# EAGLE design eDNA Board V2 (EAGLE 9.6.2)

## Sheet 1 of 2: Logic + Sensor
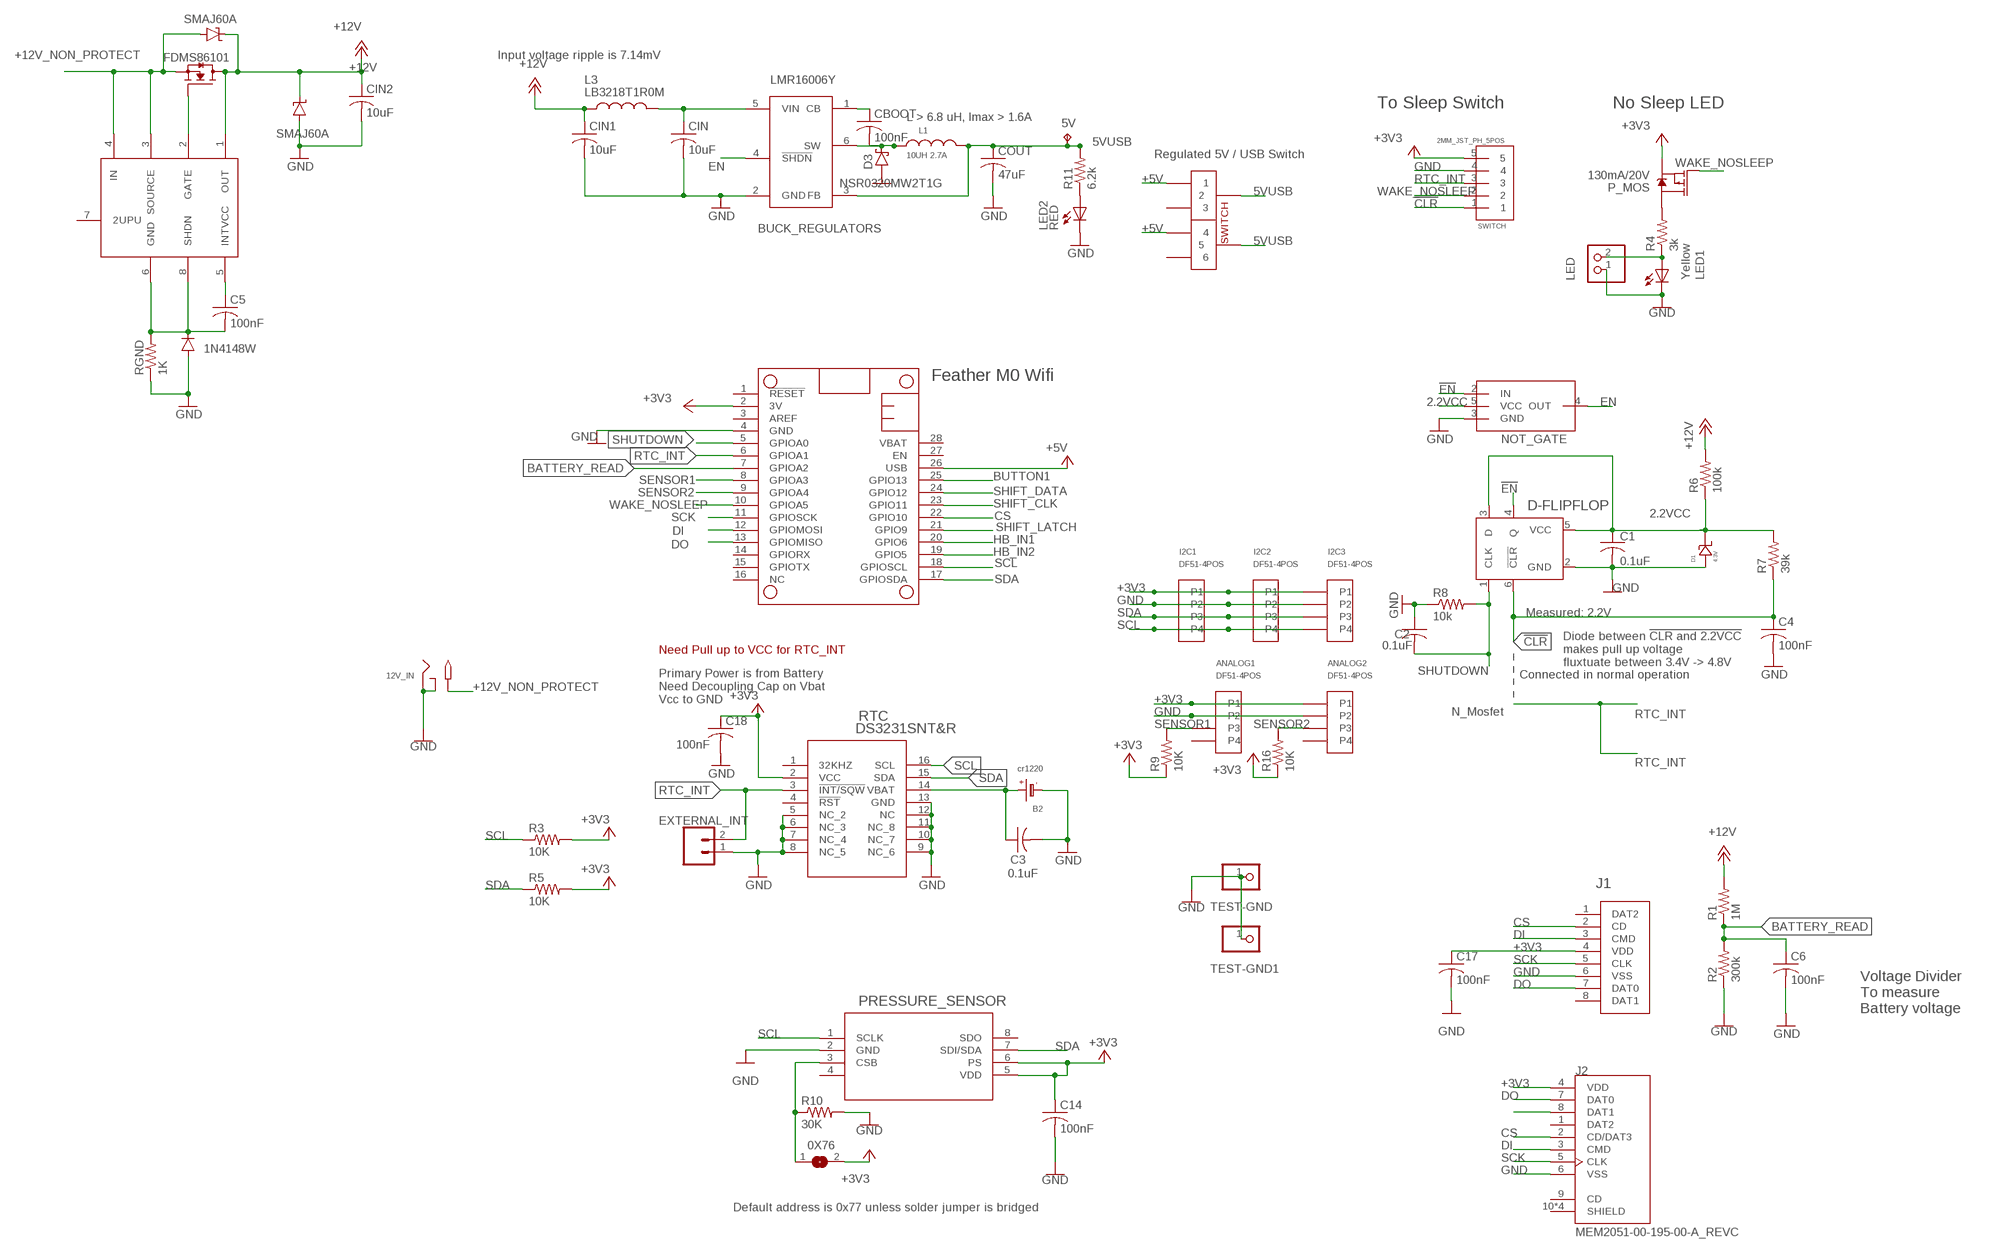
[diagram p0: schematic, sheet 1]

### Parts
0X76  SJ  [SJ]
5V  TPTP16R  [TP16R]
12V_IN  2.1MMJACKSMT  [DCJACK_2MM_SMT]
ANALOG1  DF51-4POS  [DF51-4POS]
ANALOG2  DF51-4POS  [DF51-4POS]
B2  cr1220  BATTERYCR1220_2  [CR1220-2]
C1  0.1uF  C-USC1206  [C1206]
C2  0.1uF  C-USC1206  [C1206]
C3  0.1uF  C-USC1206  [C1206]
C4  100nF  C-USC1206  [C1206]
C5  100nF  C-USC1206  [C1206]
C6  100nF  C-USC1206  [C1206]
C14  100nF  C-USC1206  [C1206]
C17  100nF  C-USC1206  [C1206]
C18  100nF  C-USC1206  [C1206]
CBOOT  100nF  C-USC1206  [C1206]
CIN  10uF  C-USC1206K  [C1206K]
CIN1  10uF  C-USC1206K  [C1206K]
CIN2  10uF  C-USC1206K  [C1206K]
COUT  47uF  C-USC1206  [C1206]
D1  4.3V  ZENER-DO219  [DO-219AC]
D2  1N4148W  [SOD-123_MINI-SMA]
D3  NSR0320MW2T1G  BAT60J  [SOD323_ST]
D4  SMAJ60A  [DO_214]
D5  SMAJ60A  [DO_214]
D-FLIPFLOP  SN74LVC1G175DBVR  [DBV6]
EXTERNAL_INT  CONN_021X02_NO_SILK  [1X02_NO_SILK]
I2C1  DF51-4POS  [DF51-4POS]
I2C2  DF51-4POS  [DF51-4POS]
I2C3  DF51-4POS  [DF51-4POS]
J1  PJS008U-3000-0  [CONN_PJS008U-3000-0_YAM]
J2  MEM2051-00-195-00-A_REVC  [GCT_MEM2051-00-195-00-A_REVC]
L1  10UH 2.7A  WE-MAPI_4030_74438357100  [WE-MAPI_40XX]
L3  LB3218T1R0M  [INDC3218X200N]
LED  2.5MM_JST_UP_2POS  [JST_2POS_2.5MM_UP]
LED1  Yellow  LEDCHIPLED_0805  [CHIPLED_0805]
LED2  RED  LEDCHIPLED_0805  [CHIPLED_0805]
MS1  FEATHERWING  [FEATHERWING]
NMOS  FDMS86101  [8-POWERTDFN]
P_MOS  130mA/20V  MOSFET_PCH-IRLML2244  [SOT23-3]
PRESSURE_SENSOR  MS580302BA01-00  [MS5803-02BA01]
R1  1M  R-US_R1206  [R1206]
R2  300k  R-US_R1206  [R1206]
R3  10K  R-US_R1206  [R1206]
R4  3k  R-US_R1206  [R1206]
R5  10K  R-US_R1206  [R1206]
R6  100k  R-US_R1206  [R1206]
R7  39k  R-US_R1206  [R1206]
R8  10k  R-US_R1206  [R1206]
R9  10K  R-US_R1206  [R1206]
R10  30K  R-US_R1206  [R1206]
R11  6.2k  WSLP1206R0500FEA  [RES_1206]
R16  10K  R-US_R1206  [R1206]
RGND  1K  R-US_R1206  [R1206]
RTC  DS3231SNT&R  [21-0042B_16]
SWITCH  2MM_JST_PH_5POS  [2MM_5POS_HEADER]
TEST-GND  PINHD-1X1  [1X01]
TEST-GND1  PINHD-1X1  [1X01]
U$1  2PDT_SWITCHJS-SMD  [JS-DPDT-SMD]
U$3  NOT_GATE  [SOT753]
U$7  LTC4372  [SOP65P640X120-8N]
VREG  BUCK_REGULATORS  [SOT23-6]

### Nets
2.2VCC [sig]: C1.1 D1.FNT D-FLIPFLOP.3(D) D-FLIPFLOP.5(VCC) R6.1 R7.2 U$3.5(VCC)
5VUSB: 5V.TP COUT.1 L1.2 R11.2 U$1.P$2 U$1.P$5 VREG.3(FB)
!CLR: C4.1 D-FLIPFLOP.6(!CLR) R7.1 SWITCH.1
!EN: D-FLIPFLOP.4(Q) U$3.2(IN)
+3V3: 0X76.2 ANALOG1.P$1(P1) ANALOG2.P$1(P1) C14.1 C17.1 C18.1 I2C1.P$1(P1) I2C2.P$1(P1) I2C3.P$1(P1) J1.4(VDD) J2.4(VDD) MS1.2(3V) P_MOS.2(S) PRESSURE_SENSOR.5(VDD) PRESSURE_SENSOR.6(PS) R3.2 R5.2 R9.1 R16.1 RTC.2(VCC) SWITCH.5 ; also sheet 2
+5V: MS1.26(USB) U$1.P$1 U$1.P$4 ; also sheet 2
+12V [12v]: CIN1.1 CIN2.1 D4.C D5.C L3.1 NMOS.5(D) NMOS.6(D) NMOS.7(D) NMOS.8(D) NMOS.9(D) R1.2 R6.2 U$7.1(OUT) ; also sheet 2
+12V_NON_PROTECT [12v]: 12V_IN.PWR2(TIP) D5.A NMOS.1(S) NMOS.2(S) NMOS.3(S) U$7.3(SOURCE) U$7.4(IN)
BATTERY_READ: C6.1 MS1.7(GPIOA2) R1.1 R2.2
BUTTON1: MS1.25(GPIO13)
CS: J1.2(CD) J2.2(CD/DAT3) MS1.22(GPIO10)
DI: J1.3(CMD) J2.3(CMD) MS1.12(GPIOMOSI)
DO: J1.7(DAT0) J2.7(DAT0) MS1.13(GPIOMISO)
EN: U$3.4(OUT) VREG.4(!SHDN)
GND: 12V_IN.GND(RING) 12V_IN.GNDBREAK(RING_SW) ANALOG1.P$2(P2) ANALOG2.P$2(P2) B2.- C1.2 C2.1 C3.2 C4.2 C6.2 C14.2 C17.2 C18.2 CIN1.2 CIN2.2 CIN.2 COUT.2 D1.BCK D2.A D3.A D4.A D-FLIPFLOP.2(GND) EXTERNAL_INT.1 I2C1.P$2(P2) I2C2.P$2(P2) I2C3.P$2(P2) J1.6(VSS) J2.6(VSS) LED1.C LED2.C LED.1 MS1.4(GND) PRESSURE_SENSOR.2(GND) R2.1 R8.1 R10.2 RGND.1 RTC.5(NC_2) RTC.6(NC_3) RTC.7(NC_4) RTC.8(NC_5) RTC.9(NC_6) RTC.10(NC_7) RTC.11(NC_8) RTC.12(NC) RTC.13(GND) SWITCH.4 TEST-GND1.1 TEST-GND.1 U$3.3(GND) VREG.2(GND) ; also sheet 2
HB_IN1: MS1.20(GPIO6) ; also sheet 2
HB_IN2: MS1.19(GPIO5) ; also sheet 2
N$1: B2.+ C3.1 RTC.14(VBAT)
N$2: P_MOS.3(D) R4.2
N$3: LED1.A LED.2 R4.1
N$6: 0X76.1 PRESSURE_SENSOR.3(CSB) R10.1
N$8: NMOS.4(G) U$7.2(GATE)
N$10: J2.8(DAT1)
N$12: LED2.A R11.1
N$15: CIN.1 L3.2 VREG.5(VIN)
N$16: CBOOT.1 VREG.1(CB)
N$17: CBOOT.2 D3.C L1.1 VREG.6(SW)
N$18: C5.1 U$7.5(INTVCC)
N$19: C5.2 D2.C RGND.2 U$7.6(GND) U$7.8(SHDN)
RTC_INT: EXTERNAL_INT.2 MS1.6(GPIOA1) RTC.3(!INT/SQW) SWITCH.3
SCK: J1.5(CLK) J2.5(CLK) MS1.11(GPIOSCK)
SCL: I2C1.P$4(P4) I2C2.P$4(P4) I2C3.P$4(P4) MS1.18(GPIOSCL) PRESSURE_SENSOR.1(SCLK) R3.1 RTC.16(SCL)
SDA: I2C1.P$3(P3) I2C2.P$3(P3) I2C3.P$3(P3) MS1.17(GPIOSDA) PRESSURE_SENSOR.7(SDI/SDA) R5.1 RTC.15(SDA)
SENSOR1: ANALOG1.P$3(P3) MS1.8(GPIOA3) R9.2
SENSOR2: ANALOG2.P$3(P3) MS1.9(GPIOA4) R16.2
SHIFT_CLK: MS1.23(GPIO11) ; also sheet 2
SHIFT_DATA: MS1.24(GPIO12) ; also sheet 2
SHIFT_LATCH: MS1.21(GPIO9) ; also sheet 2
SHUTDOWN: C2.2 D-FLIPFLOP.1(CLK) MS1.5(GPIOA0) R8.2
WAKE_NOSLEEP: MS1.10(GPIOA5) P_MOS.1(G) SWITCH.2
Unconnected: ANALOG1.P$4(P4) ANALOG2.P$4(P4) J1.1(DAT2) J1.8(DAT1) J2.1(DAT2) J2.9(CD) J2.10(SHIELD) J2.11(SHIELD) J2.12(SHIELD) J2.13(SHIELD) MS1.1(!RESET) MS1.3(AREF) MS1.14(GPIORX) MS1.15(GPIOTX) MS1.16(NC) MS1.27(EN) MS1.28(VBAT) PRESSURE_SENSOR.4(NC) PRESSURE_SENSOR.8(SDO) RTC.1(32KHZ) RTC.4(!RST) U$1.P$3 U$1.P$6 U$7.7(2UPU)

### Notes on the sheet
- Input voltage ripple is 7.14mV
- To Sleep Switch | No Sleep LED
- L > 6.8 uH, Imax > 1.6A
- Regulated 5V / USB Switch
- Feather M0 Wifi
- Measured: 2.2V
- Need Pull up to VCC for RTC_INT
- Diode between !CLR and 2.2VCC
  makes pull up voltage 
  fluxtuate between 3.4V -> 4.8V
- Connected in normal operation
- Primary Power is from Battery
  Need Decoupling Cap on Vbat
  Vcc to GND
- N_Mosfet
- Voltage Divider
  To measure 
  Battery voltage
- Default address is 0x77 unless solder jumper is bridged

## Sheet 2 of 2: Power
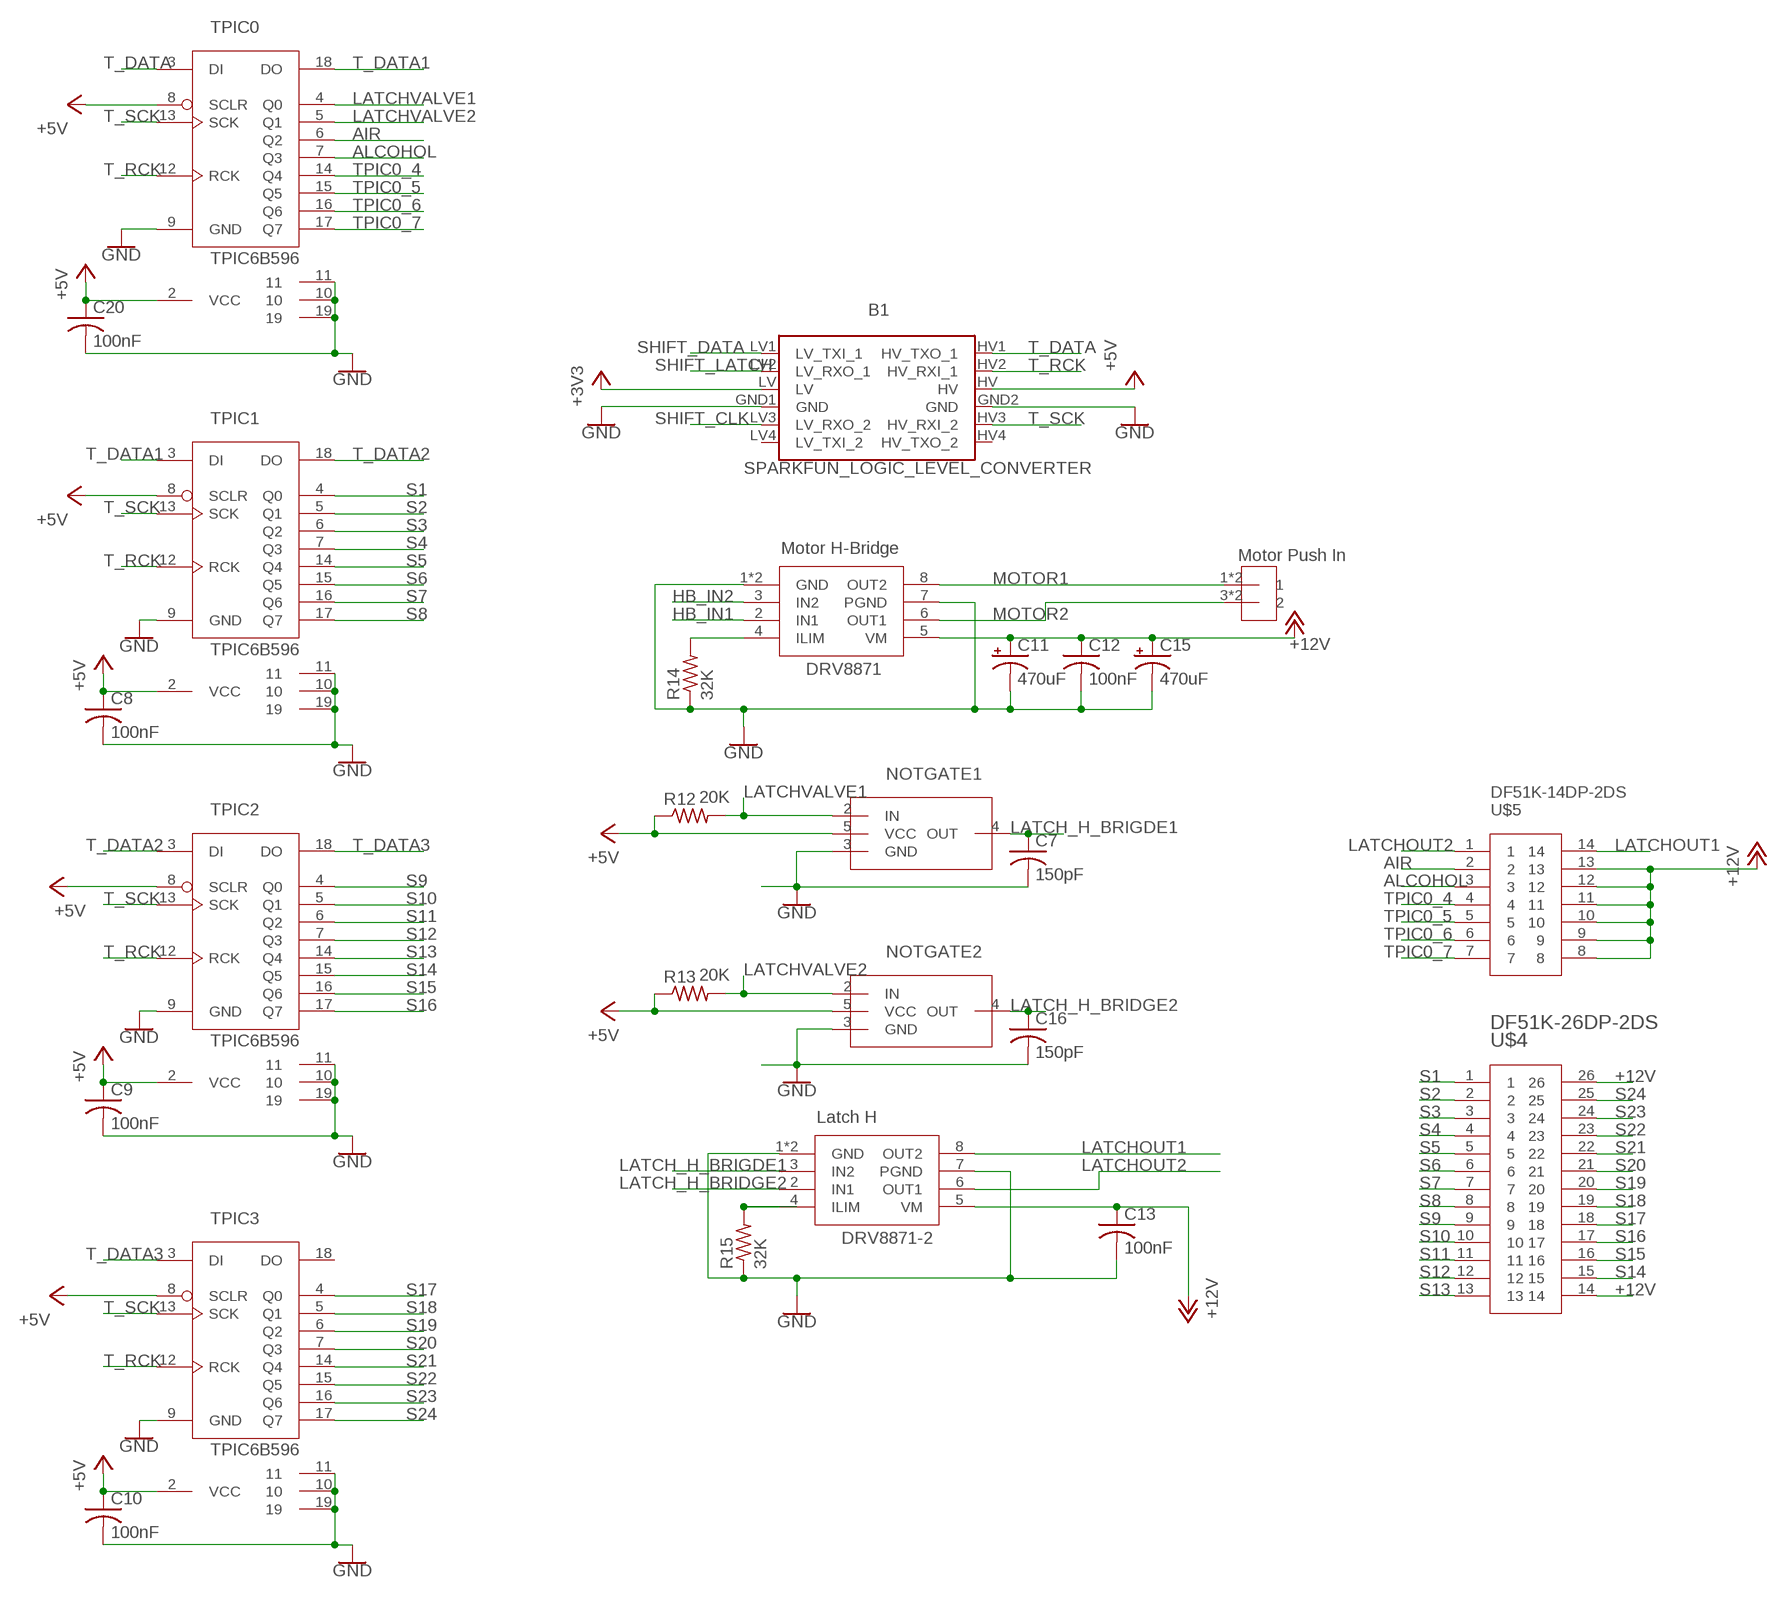
[diagram p1: schematic, sheet 2]

### Parts
B1  SPARKFUN_LOGIC_LEVEL_CONVERTER  [SPARKFUN_LOGIC_LEVEL_CONVERTER]
C7  150pF  C-USC1206  [C1206]
C8  100nF  C-USC1206  [C1206]
C9  100nF  C-USC1206  [C1206]
C10  100nF  C-USC1206  [C1206]
C11  470uF  CPOL-US140CLH-0810  [140CLH-0810]
C12  100nF  C-USC1206  [C1206]
C13  100nF  C-USC1206  [C1206]
C15  470uF  CPOL-US140CLH-0810  [140CLH-0810]
C16  150pF  C-USC1206  [C1206]
C20  100nF  C-USC1206  [C1206]
DRV8871  Motor H-Bridge  DRV8871  [SOP8]
DRV8871-2  Latch H  DRV8871  [SOP8]
NOTGATE1  NOT_GATE  [SOT753]
NOTGATE2  NOT_GATE  [SOT753]
R12  20K  R-US_R1206  [R1206]
R13  20K  R-US_R1206  [R1206]
R14  32K  R-US_R1206  [R1206]
R15  32K  R-US_R1206  [R1206]
TPIC0  TPIC6B596  [DIP20]
TPIC1  TPIC6B596  [DIP20]
TPIC2  TPIC6B596  [DIP20]
TPIC3  TPIC6B596  [DIP20]
U$2  Motor Push In  PUSH_IN_2  [3.5MM_DIP2]
U$4  DF51K-26DP-2DS  [DF51K-26DP-2DS-ANGLE]
U$5  DF51K-14DP-2DS  [DF51K-14DP-2DS-ANGLE]

### Nets
+3V3: B1.LV ; also sheet 1
+5V: B1.HV C8.1 C9.1 C10.1 C20.1 NOTGATE1.5(VCC) NOTGATE2.5(VCC) R12.1 R13.1 TPIC0.2(VCC) TPIC0.8(SCLR) TPIC1.2(VCC) TPIC1.8(SCLR) TPIC2.2(VCC) TPIC2.8(SCLR) TPIC3.2(VCC) TPIC3.8(SCLR) ; also sheet 1
+12V [12v]: C11.+ C12.1 C13.1 C15.+ DRV8871-2.5(VM) DRV8871.5(VM) U$4.14 U$4.26 U$5.8 U$5.9 U$5.10 U$5.11 U$5.12 U$5.13 ; also sheet 1
AIR: TPIC0.6(Q2) U$5.2
ALCOHOL: TPIC0.7(Q3) U$5.3
GND: B1.GND1(GND) B1.GND2(GND) C7.2 C8.2 C9.2 C10.2 C11.- C12.2 C13.2 C15.- C16.2 C20.2 DRV8871-2.1(GND) DRV8871-2.7(PGND) DRV8871-2.GND DRV8871.1(GND) DRV8871.7(PGND) DRV8871.GND NOTGATE1.3(GND) NOTGATE2.3(GND) R14.1 R15.1 TPIC0.9(GND) TPIC0.10 TPIC0.11 TPIC0.19 TPIC1.9(GND) TPIC1.10 TPIC1.11 TPIC1.19 TPIC2.9(GND) TPIC2.10 TPIC2.11 TPIC2.19 TPIC3.9(GND) TPIC3.10 TPIC3.11 TPIC3.19 ; also sheet 1
HB_IN1: DRV8871.2(IN1) ; also sheet 1
HB_IN2: DRV8871.3(IN2) ; also sheet 1
LATCH_H_BRIDGE2: C16.1 DRV8871-2.2(IN1) NOTGATE2.4(OUT)
LATCH_H_BRIGDE1: C7.1 DRV8871-2.3(IN2) NOTGATE1.4(OUT)
LATCHOUT1: DRV8871-2.8(OUT2) U$5.14
LATCHOUT2: DRV8871-2.6(OUT1) U$5.1
LATCHVALVE1: NOTGATE1.2(IN) R12.2 TPIC0.4(Q0)
LATCHVALVE2: NOTGATE2.2(IN) R13.2 TPIC0.5(Q1)
MOTOR1: DRV8871.8(OUT2) U$2.1 U$2.2
MOTOR2: DRV8871.6(OUT1) U$2.3 U$2.4
N$4: DRV8871.4(ILIM) R14.2
N$5: DRV8871-2.4(ILIM) R15.2
S1: TPIC1.4(Q0) U$4.1
S2: TPIC1.5(Q1) U$4.2
S3: TPIC1.6(Q2) U$4.3
S4: TPIC1.7(Q3) U$4.4
S5: TPIC1.14(Q4) U$4.5
S6: TPIC1.15(Q5) U$4.6
S7: TPIC1.16(Q6) U$4.7
S8: TPIC1.17(Q7) U$4.8
S9: TPIC2.4(Q0) U$4.9
S10: TPIC2.5(Q1) U$4.10
S11: TPIC2.6(Q2) U$4.11
S12: TPIC2.7(Q3) U$4.12
S13: TPIC2.14(Q4) U$4.13
S14: TPIC2.15(Q5) U$4.15
S15: TPIC2.16(Q6) U$4.16
S16: TPIC2.17(Q7) U$4.17
S17: TPIC3.4(Q0) U$4.18
S18: TPIC3.5(Q1) U$4.19
S19: TPIC3.6(Q2) U$4.20
S20: TPIC3.7(Q3) U$4.21
S21: TPIC3.14(Q4) U$4.22
S22: TPIC3.15(Q5) U$4.23
S23: TPIC3.16(Q6) U$4.24
S24: TPIC3.17(Q7) U$4.25
SHIFT_CLK: B1.LV3(LV_RXO_2) ; also sheet 1
SHIFT_DATA: B1.LV1(LV_TXI_1) ; also sheet 1
SHIFT_LATCH: B1.LV2(LV_RXO_1) ; also sheet 1
T_DATA: B1.HV1(HV_TXO_1) TPIC0.3(DI)
T_DATA1: TPIC0.18(DO) TPIC1.3(DI)
T_DATA2: TPIC1.18(DO) TPIC2.3(DI)
T_DATA3: TPIC2.18(DO) TPIC3.3(DI)
T_RCK: B1.HV2(HV_RXI_1) TPIC0.12(RCK) TPIC1.12(RCK) TPIC2.12(RCK) TPIC3.12(RCK)
T_SCK: B1.HV3(HV_RXI_2) TPIC0.13(SCK) TPIC1.13(SCK) TPIC2.13(SCK) TPIC3.13(SCK)
TPIC0_4: TPIC0.14(Q4) U$5.4
TPIC0_5: TPIC0.15(Q5) U$5.5
TPIC0_6: TPIC0.16(Q6) U$5.6
TPIC0_7: TPIC0.17(Q7) U$5.7
Unconnected: B1.HV4(HV_TXO_2) B1.LV4(LV_TXI_2) TPIC3.18(DO)

## Library data of the parts
0X76 = jumper:SJ: SMD solder JUMPER
5V = testpad:TP: Test pad
12V_IN = adafruit:2.1MMJACK: 2.1mm x 5.5mm THM DC jack with internal switch. Digikey part #PJ-102A, 4UCON part #05537 2.1mm x 5.5mm SMT DC jack with internal switch. Digikey part #PJ-002A-SMT, 4UCON part #03267 By microbuilder.eu & adafruit.com
ANALOG1 ANALOG2 I2C1-I2C3 = HiroseConnectors:DF51-4POS
B1 = SparkFun-Boards:SPARKFUN_LOGIC_LEVEL_CONVERTER: SparkFun Logic Level Converter -Bi-Directional This is the mechnical outline for the 3.3V - 5V bi directional logic level converter. *Note, the "LOCK" Package has the header pins staggered by an offset of 5 mils (off center line), so that when you slide a row of standard 0.1" headers into the PTH pads, it will hold position vertically. See the follwing turorial for more information on this type of special footprints: Sneaky Footprints <https://www.sparkfun.com/tutorials/114> SparkFun Products: SparkFun Logic Level Converter - Bi-Directional <https://www.sparkfun.com/products/12009>
B2 = microbuilder:BATTERY: CR1220 SMT - Digikey: 3001K-ND CD2032 BAT-HLD-001 - Digikey: BAT-HLD-001-ND
C1-C3 C14 = adafruit:C-US: CAPACITOR, American symbol
C4-C10 C12 C13 C16-C18 C20 = resistor:C-US: CAPACITOR, American symbol
C11 C15 = adafruit:CPOL-US: POLARIZED CAPACITOR, American symbol
CBOOT CIN CIN1 CIN2 COUT = rcl:C-US: CAPACITOR, American symbol; SPICEPREFIX: C
D1 = beach:ZENER-DO219
D2 = Sampler-eDNA:1N4148W
D3 = diode:BAT60J: Schottky barrier diode Source: www.st.com, BAT60J.pdf
D4 D5 = Sampler-eDNA:SMAJ60A
D-FLIPFLOP = eDNA:SN74LVC1G175DBVR: D Flipflop with clear - https://www.digikey.com/product-detail/en/texas-instruments/SN74LVC1G175DBVR/296-17617-1-ND/706599; MANUFACTURER_PART_NUMBER: SN74LVC1G175DBVR; VENDOR: Texas Instruments
DRV8871 DRV8871-2 = eDNA:DRV8871
EXTERNAL_INT = SparkFun-Connectors:CONN_02: Multi connection point. Often used as Generic Header-pin footprint for 0.1 inch spaced/style header connections On any of the 0.1 inch spaced packages, you can populate with these: Break Away Headers - Straight <https://www.sparkfun.com/products/116> (PRT-00116) Break Away Male Headers - Right Angle <https://www.sparkfun.com/products/553> (PRT-00553) Female Headers <https://www.sparkfun.com/products/115> (PRT-00115) Break Away Headers - Machine Pin <https://www.sparkfun.com/products/117> (PRT-00117) Break Away Female Headers - Swiss Machine Pin <https://www.sparkfun.com/products/743> (PRT-00743) For SCREWTERMINALS and SPRING TERMINALS visit here: Screw Terimnals on SparkFun.com <https://www.sparkfun.com/search/results?term=Screw+Terminals> (5mm/3.5mm/2.54mm spacing) This device is also useful as a general connection point to wire up your design to another part of your project. Our various solder wires solder well into these plated through hole pads. Hook-Up Wire - Assortment (Stranded, 22 AWG) <https://www.sparkfun.com/products/11375> (PRT-11375) Hook-Up Wire - Assortment (Solid Core, 22 AWG) <https://www.sparkfun.com/products/11367> (PRT-11367) View the entire wire category on our website here <https://www.sparkfun.com/categories/141> Special notes: Molex polarized connector foot print use with: PRT-08233 with associated crimp pins and housings. 2.54_SCREWTERM for use with PRT-10571. 3.5mm Screw Terminal footprints for PRT-08084 5mm Screw Terminal footprints for use with PRT-08432
J1 = Sampler-eDNA:PJS008U-3000-0; BUILT_BY: EMA_Anthony; COPYRIGHT: Copyright (C) 2018 Accelerated Designs. All rights reserved; MANUFACTURER_PART_NUMBER: PJS008U-3000-0; SOURCELIBRARY: Yamaichi_2019-10-11; VENDOR: Yamaichi
J2 = Sampler-eDNA:MEM2051-00-195-00-A_REVC: Micro SD Memory Card Connector, 1.88mm Profile SMT,Push Push, with normally closed switch Check prices <https://pricing.snapeda.com/parts/MEM2051-00-195-00-A/Global%20Connector%20Technology/view-part?ref=eda>; AVAILABILITY: Warning; DESCRIPTION: 9 (8 + 1) Position Card Connector microSD Surface Mount, Right Angle Gold, 1.95mm profile, Normally open switch, Push push, Top mount; MF: Global Connector Technology; MP: MEM2051-00-195-00-A; PACKAGE: None; PRICE: None
L1 = EMCComponents (rev19e):WE-MAPI_4030: SMD Metal Alloy Power Inductor Characteristics Magnetic iron alloy allows high rated currents Compact design Magnetically shielded High current capability and handles high transient current spikes Low acoustic noise and low leakage flux noise Operating temperature: –40 °C to 125 °C Applications DC/DC-converter for high current power supplies DC/DC-converter for Field Programmable Gate Array (FPGA) POL-converters Portable power like PDA, digital camera Mainboards/graphic cards Battery powered devices Wireless communication devices Power supplies for smartphones, tablet PCs and other mobile devices <http://katalog.we-online.de/media/images/v2/Family_WE-MAPI.jpg> Details see: http://katalog.we-online.de/en/pbs/WE-MAPI? Updated by Dan Xu 2014-07-08 2014 (C) Wurth Elektronik; WE-NUMBER: 74438357100/10uH
L3 = LB3218T1R0M:LB3218T1R0M: INDUCTOR, 1µH, 1.075A, ±20%; Inductance:1µH; Inductance Tolerance:± 20%; DC Resistance Max:60mohm; DC Current Rating:1.075A; Self Resonant Frequency:100MHz; Series:LB; Core Material:Ferrite; Inductor Case Style:SMD; No. of Pins:2 ;RoHS Compliant: No; DESCRIPTION: 1µH Unshielded Wirewound Inductor 1.075A 60mOhm 1207 (3218 Metric); DIGI-KEY_PART_NUMBER: 587-2032-1-ND; MF: Taiyo Yuden; MP: LB3218T1R0M; PACKAGE: 3218 Taiyo Yuden; PURCHASE-URL: https://pricing.snapeda.com/search/part/LB3218T1R0M/?ref=eda
LED = eDNA:2.5MM_JST_UP_2POS
LED1 LED2 = adafruit:LED: LED OSRAM: - CHIPLED LG R971, LG N971, LY N971, LG Q971, LY Q971, LO R971, LY R971 LH N974, LH R974 LS Q976, LO Q976, LY Q976 LO Q996 - Hyper CHIPLED LW Q18S LB Q993, LB Q99A, LB R99A - SideLED LS A670, LO A670, LY A670, LG A670, LP A670 LB A673, LV A673, LT A673, LW A673 LH A674 LY A675 LS A676, LA A676, LO A676, LY A676, LW A676 LS A679, LY A679, LG A679 - Hyper Micro SIDELED® LS Y876, LA Y876, LO Y876, LY Y876 LT Y87S - SmartLED LW L88C, LW L88S LB L89C, LB L89S, LG L890 LS L89K, LO L89K, LY L89K LS L896, LA L896, LO L896, LY L896 - TOPLED LS T670, LO T670, LY T670, LG T670, LP T670 LSG T670, LSP T670, LSY T670, LOP T670, LYG T670 LG T671, LOG T671, LSG T671 LB T673, LV T673, LT T673, LW T673 LH T674 LS T676, LA T676, LO T676, LY T676, LB T676, LH T676, LSB T676, LW T676 LB T67C, LV T67C, LT T67C, LS T67K, LO T67K, LY T67K, LW E67C LS E67B, LA E67B, LO E67B, LY E67B, LB E67C, LV E67C, LT E67C LW T67C LS T679, LY T679, LG T679 LS T770, LO T770, LY T770, LG T770, LP T770 LB T773, LV T773, LT T773, LW T773 LH T774 LS E675, LA E675, LY E675, LS T675 LS T776, LA T776, LO T776, LY T776, LB T776 LHGB T686 LT T68C, LB T68C - Hyper Mini TOPLED® LB M676 - Mini TOPLED Santana® LG M470 LS M47K, LO M47K, LY M47K Source: http://www.osram.convergy.de/
MS1 = adafruit:FEATHERWING
NMOS = Sampler-eDNA:FDMS86101
NOTGATE1 NOTGATE2 U$3 = eDNA:NOT_GATE
P_MOS = SparkFun-DiscreteSemi:MOSFET_PCH: P-channel MOSFETs Voltage controlled devices that allow control of high current outputs. SparkFun Products: SparkFun ESP32 Thing <https://www.sparkfun.com/products/13907> SparkFun ESP8266 Thing <https://www.sparkfun.com/products/13231>; PROD_ID: TRANS-11153; VALUE: 4.3A/20V/54mΩ
PRESSURE_SENSOR = eDNA:MS580302BA01-00: Pressure sensor https://www.digikey.com/product-detail/en/te-connectivity-measurement-specialties/MS580302BA01-00/223-1624-5-ND/5277629; MANUFACTURER_PART_NUMBER: MS580302BA0100; VENDOR: TE Connectivity
R1 R2 R6-R8 R10 R12 R13 = adafruit:R-US_: RESISTOR, American symbol
R3 R5 R9 R14-R16 RGND = rcl:R-US_: RESISTOR, American symbol; SPICEPREFIX: R
R4 = resistor:R-US_: RESISTOR, American symbol
R11 = Resistor_Capacitor:WSLP1206R0500FEA: RES 0.05 OHM 1% 1W 1206 Manufacturer's datasheet <http://www.vishay.com/docs/30122/wslp.pdf>; CREATED_BY: PCBLayout.com; DIGIKEY_PART_NUMBER: WSLP-.05TR-ND; MANUFACTURER: Vishay Dale; MPN: WSLP1206R0500FEA; PACKAGE: SMD 1206
RTC = eDNA:DS3231SNT&R: Real-time clock, RTC, DS3231 https://www.digikey.com/products/en?keywords=DS3231SN%23T%26RCT-ND; MANUFACTURER_PART_NUMBER: DS3231SN#T&R; VENDOR: Maxim Integrated Products
SWITCH = eDNA:2MM_JST_PH_5POS: 5POS JST female, 5 position https://www.digikey.com/product-detail/en/jst-sales-america-inc/B5B-PH-K-S-LF-SN/455-1707-ND/926614
TEST-GND TEST-GND1 = adafruit:PINHD-1X1: Pin header 1x1 for 0.1" spacing With round pins
TPIC0 TPIC1-TPIC3 = eDNA:TPIC6B596
U$1 = eDNA:2PDT_SWITCH: Double Pole Double Throw ON OFF ON switch. https://www.digikey.com/product-detail/en/e-switch/100DP1T1B1M2QEH/EG2400-ND/378869
U$2 = eDNA:PUSH_IN_2: Push in to connect Phoenix Contact - 3.5 mm through hole Can be ordered from : https://www.digikey.com/product-detail/en/phoenix-contact/1864286/277-12184-ND/6605434 OpenSensingLab OSU
U$4 = Sampler-eDNA:DF51K-26DP-2DS
U$5 = Sampler-eDNA:DF51K-14DP-2DS
U$7 = Sampler-eDNA:LTC4372
VREG = eDNA:BUCK_REGULATORS

## Net classes
1 12v: width 0.356 mm, clearance 0.254 mm
3 sig: width 0.152 mm, clearance 0.2 mm

## Board
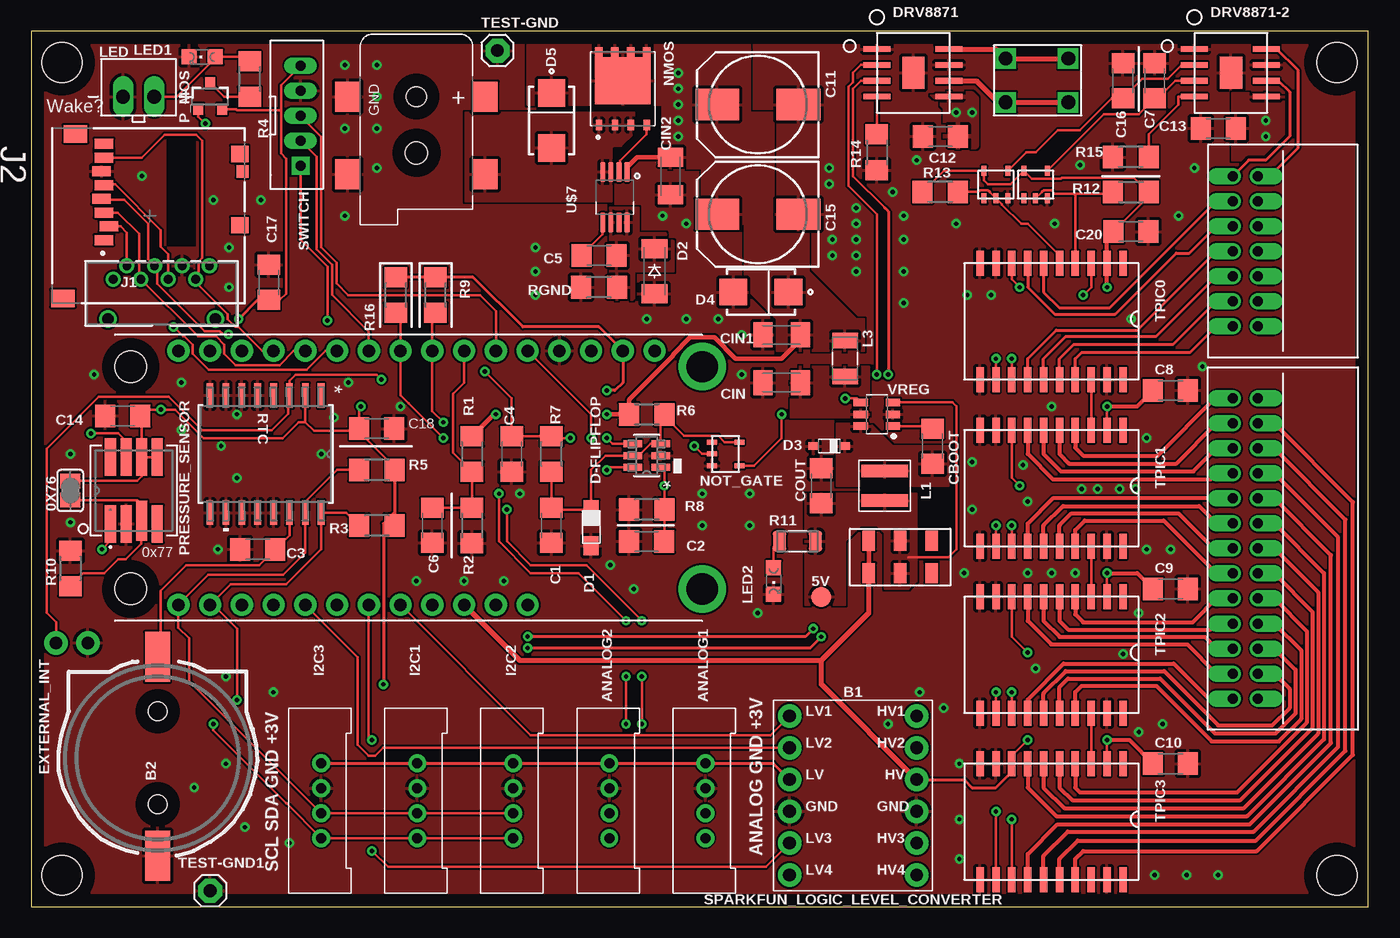
[diagram p2: board, top side]
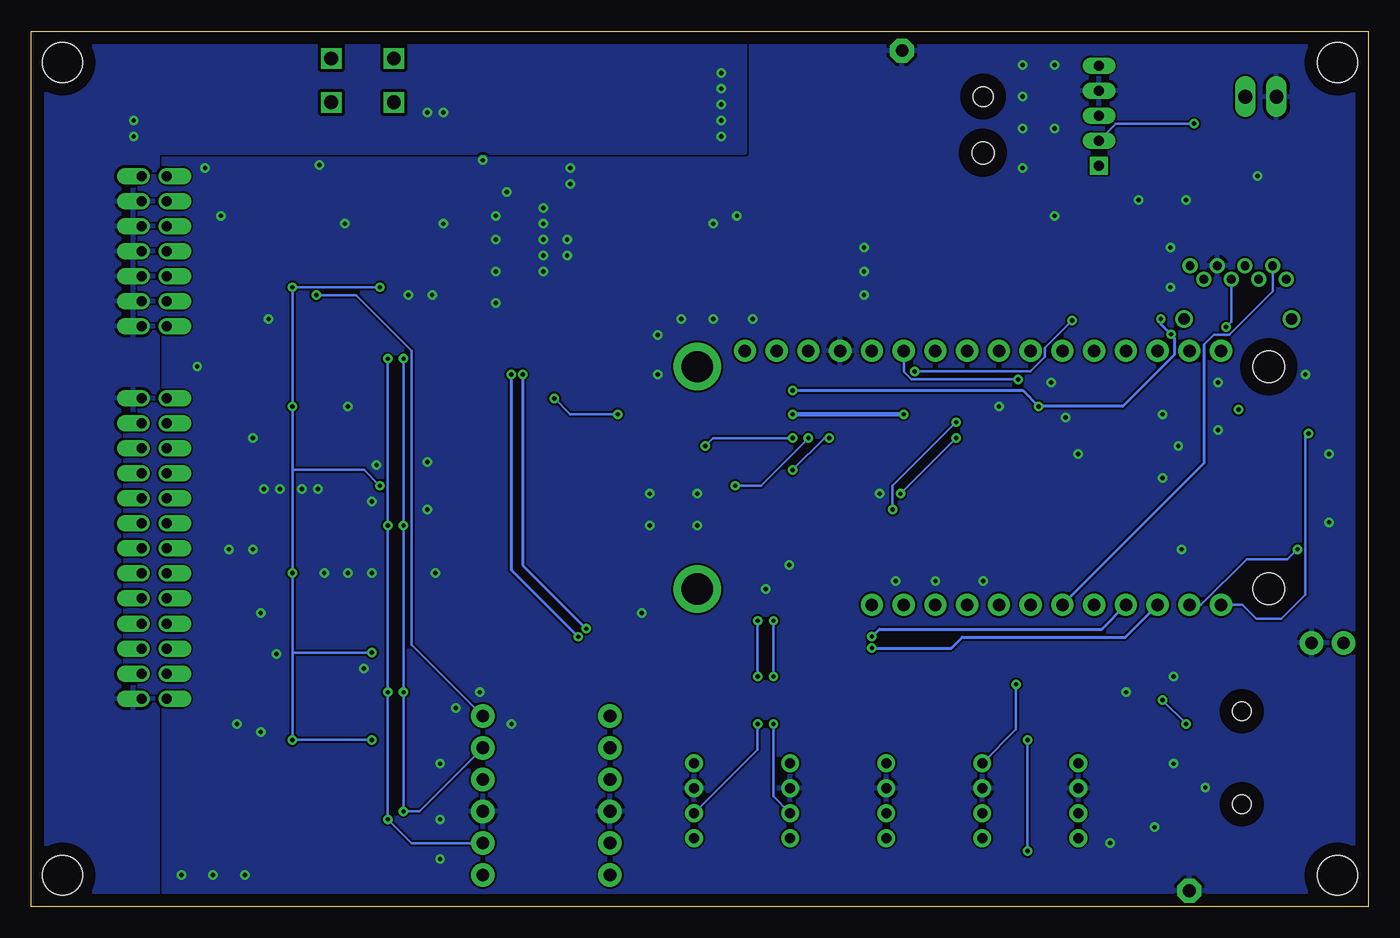
[diagram p3: board, bottom side, seen from below]

Size 106.95 x 70 mm. Coordinates in mm from the lower left corner, seen from the top.
Outline: 0,0 106.95,0 106.95,70 0,70 0,0
Copper layers (1*16): Top 0.035mm / dielectric 1.5mm / Bottom 0.035mm
Design rules "default *": minimum track width 6mil, minimum drill 0.35mm, track to track 6mil, track to pad 6mil, pad to pad 6mil, via to via 6mil, smd to smd 6mil, copper to edge 40mil, drill to drill 6mil, minimum pad ring 10mil, minimum via ring 8mil, stop-mask expansion 4mil, vias tented up to drill 35mil, thermal gap 10mil
Holes 3.2 mm at 2.45,2.5 2.45,67.5 104.45,67.5 104.45,2.5

### Footprints (pad centres in the part's own frame; a part is rotated, then mirrored left to right if it is on the bottom)
SJ = smd 1.168 x 1.6: 1 -0.762,0; 2 0.762,0
TP16R = smd 1.6 x 1.6: TP 0,0
DCJACK_2MM_SMT = smd 2.4 x 2: GND 0,-5.5; GNDBREAK 6.2,-5.5; PWR1 0,5.5; PWR2 6.2,5.5 | hole 1.6: 0,0 | hole 1.8: 4.5,0
DF51-4POS = drill 0.8 pad 1.422: P$1 4.4,0; P$2 6.4,0; P$3 8.4,0; P$4 10.4,0
SPARKFUN_LOGIC_LEVEL_CONVERTER = drill 1.016 pad 1.88: GND1 -5.08,-1.27; GND2 5.08,-1.27; HV 5.08,1.27; HV1 5.08,6.35; HV2 5.08,3.81; HV3 5.08,-3.81; HV4 5.08,-6.35; LV -5.08,1.27; LV1 -5.08,6.35; LV2 -5.08,3.81; LV3 -5.08,-3.81; LV4 -5.08,-6.35
CR1220-2 = smd 4 x 2: + 8.29,0; - -7.6,0 | hole 1.5: 3.95,0; -3.5,0
C1206 = smd 1.6 x 1.8: 1 -1.4,0; 2 1.4,0
140CLH-0810 = smd 3.5 x 2.5: + 3.25,0; - -3.25,0
C1206K = smd 1.5 x 2: 1 -1.5,0; 2 1.5,0
DO-219AC = smd 1.5 x 1.2: BCK 2.9,0; FNT 0,0
SOD-123_MINI-SMA = smd 1.5 x 2.1: A 1.8,0; C -1.8,0
SOD323_ST = smd 0.8 x 0.6: A 1.25,0; C -1.25,0
DO_214 = smd 2.2 x 2.15: A 2.2,0; C -2.2,0
DBV6 = smd 1.473 x 0.559: 1 -1.118,0.95; 2 -1.118,0; 3 -1.118,-0.95; 4 1.118,-0.95; 5 1.118,0; 6 1.118,0.95
SOP8 = smd 2.15 x 0.45: 1 -2.54,1.27; 2 -2.54,0; 3 -2.54,-1.27; 4 -2.54,-2.54; 5 3.21,-2.54; 6 3.21,-1.27; 7 3.21,0; 8 3.21,1.27 | smd 1.79 x 2.541: GND 0.381,-0.635
1X02_NO_SILK = drill 1.016 pad 1.88: 1 0,0; 2 2.54,0
CONN_PJS008U-3000-0_YAM = drill 0.7 pad 1.1: 1 0,0; 2 1.092,1.092; 3 2.21,0; 4 3.302,1.092; 5 4.394,0; 6 5.512,1.092; 7 6.604,0; 8 7.696,1.092 | drill 0.9 pad 1.422: 9 -0.42,-3.175; 11 8.18,-3.175
GCT_MEM2051-00-195-00-A_REVC = smd 0.8 x 1.5: 1 1.94,-3.66; 2 0.84,-3.26; 3 -0.26,-3.66; 4 -1.36,-3.86; 5 -2.46,-3.66; 6 -3.56,-3.86; 7 -4.66,-3.66; 8 -5.76,-3.66 | smd 1 x 0.95: 9 -3.56,7.425 | smd 1.3 x 1.4: 10 -4.95,7.2; 11 0.75,7.2 | smd 1.4 x 1.9: 12 -6.55,-5.95; 13 6.6,-6.95
WE-MAPI_40XX = smd 0.98 x 3.7: 1 -1.185,0; 2 1.185,0
INDC3218X200N = smd 1.24 x 2.02: 1 -1.44,0; 2 1.44,0
JST_2POS_2.5MM_UP = drill 1.1 long: 1 -1.25,0; 2 1.25,0
CHIPLED_0805 = smd 1.2 x 1.2: A 0,-1.05; C 0,1.05
FEATHERWING = drill 1 pad 1.778: 1 6.35,1.27; 2 8.89,1.27; 3 11.43,1.27; 4 13.97,1.27; 5 16.51,1.27; 6 19.05,1.27; 7 21.59,1.27; 8 24.13,1.27; 9 26.67,1.27; 10 29.21,1.27; 11 31.75,1.27; 12 34.29,1.27; 13 36.83,1.27; 14 39.37,1.27; 15 41.91,1.27; 16 44.45,1.27; 17 44.45,21.59; 18 41.91,21.59; 19 39.37,21.59; 20 36.83,21.59; 21 34.29,21.59; 22 31.75,21.59; 23 29.21,21.59; 24 26.67,21.59; 25 24.13,21.59; 26 21.59,21.59; 27 19.05,21.59; 28 16.51,21.59 | drill 2.5 pad 3.81: P$1 2.54,20.32; P$2 2.54,2.54 | hole 2.54: 48.26,20.32; 48.26,2.54
8-POWERTDFN = smd 0.85 x 0.5: 1 -2.9,1.905; 2 -2.9,0.635; 3 -2.9,-0.635; 4 -2.9,-1.905 | smd 0.8 x 0.6: 5 2.925,-1.905; 6 2.925,-0.635; 7 2.925,0.635; 8 2.925,1.905 | smd 3.75 x 4.41: 9 0.65,0
SOT753 = smd 0.8 x 0.4: 1 -1.14,0.95; 2 -1.14,0; 3 -1.14,-0.95; 4 1.06,-0.95; 5 1.06,0.95
SOT23-3 = smd 0.8 x 0.9: 1 -0.95,-1; 2 0.95,-1; 3 0,1.1
MS5803-02BA01 = smd 3 x 0.889: 1 -2.675,1.875; 2 -2.675,0.625; 4 -2.675,-1.875; 5 2.675,-1.875; 6 2.675,-0.625; 7 2.675,0.625; 8 2.675,1.875 | smd 3.2 x 0.889: 3 -2.408,-0.625
R1206 = smd 1.6 x 1.803: 1 -1.422,0; 2 1.422,0
RES_1206 = smd 1.08 x 1.68: 1 -1.445,0; 2 1.445,0
21-0042B_16 = smd 1.981 x 0.533: 1 -4.686,4.445; 2 -4.686,3.175; 3 -4.686,1.905; 4 -4.686,0.635; 5 -4.686,-0.635; 6 -4.686,-1.905; 7 -4.686,-3.175; 8 -4.686,-4.445; 9 4.686,-4.445; 10 4.686,-3.175; 11 4.686,-1.905; 12 4.686,-0.635; 13 4.686,0.635; 14 4.686,1.905; 15 4.686,3.175; 16 4.686,4.445
2MM_5POS_HEADER = drill 0.8 pad 1.422 square: 1 -4,0 | drill 0.8 long: 2 -2,0; 3 0,0; 4 2,0; 5 4,0
1X01 = drill 1.016 pad 1.93 octagon: 1 0,0
DIP20 = smd 2 x 0.6: 1 -3.81,5.08; 2 -3.81,3.81; 3 -3.81,2.54; 4 -3.81,1.27; 5 -3.81,0; 6 -3.81,-1.27; 7 -3.81,-2.54; 8 -3.81,-3.81; 9 -3.81,-5.08; 10 -3.81,-6.35; 11 5.49,-6.35; 12 5.49,-5.08; 13 5.49,-3.81; 14 5.49,-2.54; 15 5.49,-1.27; 16 5.49,0; 17 5.49,1.27; 18 5.49,2.54; 19 5.49,3.81; 20 5.49,5.08
JS-DPDT-SMD = smd 1 x 1.6: P$1 0,0; P$2 2.5,0; P$3 5,0; P$4 0,2.6; P$5 2.5,2.6; P$6 5,2.6
3.5MM_DIP2 = drill 1.1 square: 1 -1.778,2.611; 2 -1.778,-2.389; 3 1.722,-2.389; 4 1.722,2.611
DF51K-26DP-2DS-ANGLE = drill 0.8 pad 1.118 offset: 1 0,-2; 2 2,-2; 3 4,-2; 4 6,-2; 5 8,-2; 6 10,-2; 7 12,-2; 8 14,-2; 9 16,-2; 10 18,-2; 11 20,-2; 12 22,-2; 13 24,-2; 14 24,0; 15 22,0; 16 20,0; 17 18,0; 18 16,0; 19 14,0; 20 12,0; 21 10,0; 22 8,0; 23 6,0; 24 4,0; 25 2,0; 26 0,0
DF51K-14DP-2DS-ANGLE = drill 0.8 pad 1.118 offset: 1 0,-2; 2 2,-2; 3 4,-2; 4 6,-2; 5 8,-2; 6 10,-2; 7 12,-2; 8 12,0; 9 10,0; 10 8,0; 11 6,0; 12 4,0; 13 2,0; 14 0,0
SOP65P640X120-8N = smd 1.57 x 0.41: 1 -2.87,0.975; 2 -2.87,0.325; 3 -2.87,-0.325; 4 -2.87,-0.975; 5 1.17,-0.975; 6 1.17,-0.325; 7 1.17,0.325; 8 1.17,0.975
SOT23-6 = smd 1.146 x 0.597: 1 -1.287,0.95; 2 -1.287,0; 3 -1.287,-0.95; 4 1.287,-0.95; 5 1.287,0; 6 1.287,0.95

### Placement (x,y rotation side)
0X76  3.13,33.27 90 top
5V  63.2,24.77 0 top
12V_IN  30.82,64.77 270 top
ANALOG1  53.93,15.88 270 top
ANALOG2  46.25,15.88 270 top
B1  65.74,8.89 0 top
B2  10.11,11.68 90 top
C1  41.61,30.48 270 top
C2  49.23,29.21 0 top
C3  18.12,28.57 180 top
C4  38.44,36.2 270 top
C5  45.42,52.07 0 top
C6  32.09,30.48 270 top
C7  89.87,66.04 90 top
C8  91.14,41.27 0 top
C9  91.14,25.4 0 top
C10  91.14,11.43 0 top
C11  58.12,64.14 180 top
C12  72.72,61.59 180 top
C13  94.95,62.23 180 top
C14  7.32,39.24 180 top
C15  58.12,55.37 180 top
C16  87.33,66.04 90 top
C17  19,49.91 90 top
C18  27.64,38.23 0 top
C20  87.96,53.98 0 top
CBOOT  72.09,36.83 270 top
CIN  60.02,41.91 180 top
CIN1  60.02,45.72 180 top
CIN2  51.13,58.42 270 top
COUT  63.2,33.66 90 top
D1  44.79,31.75 270 top
D2  49.87,50.8 270 top
D3  63.84,36.83 180 top
D4  58.37,49.15 180 top
D5  41.61,62.87 270 top
D-FLIPFLOP  49.23,36.07 180 top
DRV8871  70.18,67.31 0 top
DRV8871-2  95.58,67.31 0 top
EXTERNAL_INT  4.53,21.08 180 top
I2C1  30.88,15.88 270 top
I2C2  38.56,15.88 270 top
I2C3  23.2,15.88 270 top
J1  6.56,50.16 0 top
J2  9.48,55.24 270 top
L1  68.28,33.66 270 top
L3  65.1,43.81 270 top
LED  8.59,64.77 0 top
LED1  13.67,67.94 90 top
LED2  59.39,26.04 180 top
MS1  56.22,45.72 180 top
NMOS  47.33,65.41 90 top
NOTGATE1  80.34,57.78 90 top
NOTGATE2  77.17,57.78 90 top
P_MOS  14.31,64.77 0 top
PRESSURE_SENSOR  8.21,33.27 90 top
R1  35.26,36.2 90 top
R2  35.26,30.48 90 top
R3  27.64,30.48 0 top
R4  17.48,66.17 270 top
R5  27.64,34.92 0 top
R6  49.23,39.37 180 top
R7  41.61,36.2 270 top
R8  49.23,31.75 0 top
R9  32.34,48.9 270 top
R10  3.13,27.05 90 top
R11  61.3,29.21 0 top
R12  87.96,57.15 180 top
R13  72.72,57.15 0 top
R14  67.64,60.33 90 top
R15  87.96,59.94 0 top
R16  29.16,48.9 270 top
RGND  45.42,49.53 0 top
RTC  18.75,36.2 270 top
SWITCH  21.54,63.25 90 top
TEST-GND  37.29,68.45 0 top
TEST-GND1  14.31,1.27 0 top
TPIC0  82.25,47.62 270 top
TPIC1  82.25,34.29 270 top
TPIC2  82.25,20.95 270 top
TPIC3  82.25,7.62 270 top
U$1  67.01,26.67 0 top
U$2  80.34,66.04 270 top
U$3  55.58,36.2 0 top
U$4  98.12,40.64 270 top
U$5  98.12,58.42 270 top
U$7  46.69,55.88 270 top
VREG  67.64,39.37 180 top

### Tracks (layer width: path | path; a pad name or v marks a point on that pad's centre or on a via)
2.2VCC
  Top 0.203: 50.58,39.29 50.35,39.07 D-FLIPFLOP.3 49.55,37.02 48.59,36.06 48.12,36.06 D-FLIPFLOP.5 45.93,36.07 44.79,34.92 D1.FNT 41.74,31.75 C1.1 R7.2 | 50.58,39.29 R6.1 | U$3.5 55.47,37.15 54.97,37.65 52.22,37.65 50.58,39.29
5VUSB
  Top 0.203: VREG.3 73.68,40.32 73.99,40.01 73.99,28.57 73.36,27.94 70.18,27.94
  pour Top (rank 2): 61.93,33.02 70.82,33.02 70.82,26.04 70.18,25.4 68.28,25.4 68.28,29.84 67.64,30.48 66.38,30.48 65.1,29.21 65.1,24.13 61.93,24.13
!CLR  (via drill 0.35)
  Top 0.203: R7.1 41.59,37.59 | 41.59,37.59 C4.1 38.44,40.64 v36.28,42.8 | D-FLIPFLOP.6 46.25,35.12 v46.05,34.92 | v43.13,37.47 41.72,37.47 41.59,37.59 | v23.7,46.86 23.7,51.18 21.54,53.34 SWITCH.1
  Bottom 0.203: v46.05,34.92 43.52,37.47 v43.13,37.47 | v23.7,46.86 25.86,44.7 25.86,43.98 27.04,42.8 v36.28,42.8
!EN  (via drill 0.35)
  Top 0.203: D-FLIPFLOP.4 46.5,37.02 v46.05,37.47 | v53.04,36.83 53.67,36.2 U$3.2
  Bottom 0.203: v46.05,37.47 52.41,37.47 v53.04,36.83
+3V3  (via drill 0.35)
  Top 0.203: RTC.2 21.93,38.73 | 21.93,38.73 22.62,38.03 26.05,38.03 C18.1 | PRESSURE_SENSOR.5 PRESSURE_SENSOR.6 | PRESSURE_SENSOR.6 8.83,39.13 C14.1 9.23,39.75 v10.37,39.75 11.52,39.75 13.8,37.47 20.12,37.47 21.39,38.73 21.93,38.73 | 0X76.2 8.48,34.04 8.84,34.4 PRESSURE_SENSOR.6 | C18.1 26.24,39.88 v26.37,40.01 | C18.1 26.24,37.97 29.06,35.15 R5.2 | J2.4 5.71,56.52 7.45,56.52 9.35,54.61 9.35,51.77 J1.4 10.09,51.02 10.09,49.81 13.88,46.02 15.09,46.02 15.35,45.77 v15.78,45.77 | SWITCH.5 19.98,65.68 19.98,63.63 | 19.98,63.63 19.98,60.23 20.4,59.82 20.4,49.02 19.89,48.51 18.37,48.51 | P_MOS.2 16.39,63.77 16.47,63.69 19.92,63.69 19.98,63.63
  Top 0.254: R5.2 R3.2 29.06,31.52 28.17,30.63 v28.17,17.78 | v46.05,41.27 46.69,41.27 47.33,41.91 MS1.2 45.42,46.35 39.32,46.35 35.36,50.32 R9.1 R16.1 | I2C3.P$1 I2C1.P$1 I2C2.P$1 ANALOG2.P$1 ANALOG1.P$1 59.34,11.47 B1.LV | v16.59,46.99 18.11,48.51 18.37,48.51 C17.1
  Bottom 0.203: v28.17,17.78 28.17,14.18 I2C1.P$1
  Bottom 0.254: v46.05,41.27 27.64,41.27 v26.37,40.01 19.64,40.01 15.47,44.17 15.47,45.47 v15.78,45.77 16.59,46.58 v16.59,46.99
+5V  (via drill 0.35)
  Top 0.2: TPIC0.2 v86.06,49.53 | v86.06,13.34 TPIC3.2 | v86.06,26.67 TPIC2.2 | v86.06,40.01 TPIC1.2 | C20.1 89.39,56.8 R12.1 89.36,57.15 88.21,58.31 87.45,58.31 | NOTGATE2.5 76.22,58.1 76.53,57.78 78.33,57.78 NOTGATE1.5 80.05,58.19
  Top 0.203: 87.45,58.31 82.46,58.31 82.35,58.19 80.05,58.19 | v79.71,13.34 78.44,12.06 TPIC3.8 78.44,10.79 | v79.71,20.32 78.44,21.59 TPIC2.8 | v79.07,33.66 78.44,34.29 TPIC1.8 | v79.05,49.53 79.05,49.55 78.44,50.16 TPIC0.8 | R13.1 73,58.84 NOTGATE2.5
  Top 0.254: B1.HV 74.63,10.16 75.27,9.53 77.17,9.53 78.44,10.79
  Top 0.305: C20.1 86.06,53.47 v86.06,49.53 | v86.06,26.67 88.47,26.67 C9.1 | v86.06,13.34 87.83,13.34 C10.1 | v86.06,40.01 88.47,40.01 C8.1
  Top 0.356: U$1.P$1 U$1.P$4
  Top 0.406: 63.2,19.68 39.07,19.68 MS1.26 | 63.2,19.68 67.01,23.5 U$1.P$1 | B1.HV 63.2,17.78 63.2,19.68
  Bottom 0.2: v86.06,49.53 v86.06,40.01 86.06,34.92 | 86.06,33.66 v86.06,26.67 86.06,20.32 v86.06,13.34
  Bottom 0.203: v86.06,13.34 v79.71,13.34 | 86.06,20.32 v79.71,20.32 | v79.07,33.66 80.34,34.92 86.06,34.92 86.06,33.66 | v86.06,49.53 v79.05,49.53
+12V  (via drill 0.35)
  Top 0.356: U$7.1 47.66,59.13 48.45,59.92 CIN2.1 | CIN1.1 61.52,45.31 60.02,43.81 56.34,43.81 54.64,45.52 52.71,45.52 51.34,44.15 51.34,44.05 47.81,40.52 R6.2 v46.05,39.37 | R1.2 37.01,39.37 v37.16,39.37
  Bottom 0.356: v37.16,39.37 v46.05,39.37
  other vias: 98.76,62.87 98.76,61.59 51.77,66.67 51.77,65.41 51.77,64.14 51.77,62.87 51.77,61.59 73.99,63.5 75.27,63.5
  pour Top (rank 2): 39.7,64.14 50.5,64.14 50.5,59.05 53.67,59.05 53.67,56.52 55.58,54.61 59.39,54.61 59.39,63.5 57.48,63.5 57.48,69.85 39.7,69.85
  pour Bottom (rank 2): 49.87,69.85 107.65,69.85 107.65,0 96.85,0 96.85,60.33 49.87,60.33
  pour Top (rank 2): 98.12,63.5 99.39,63.5 99.39,64.77 101.93,64.77 101.93,60.33 98.12,60.33
  pour Top (rank 2): 71.96,65.02 75.27,65.02 75.65,64.64 75.65,60.83 75.52,60.71 73.11,60.71 73.11,63.88
  pour Top: 96.09,65.02 100.03,65.02 100.03,60.96 98.76,59.69 96.09,59.69
  pour Top: 57.74,55.24 57.1,54.61 57.1,49.53 59.64,46.99 59.64,44.45 66.63,44.45 66.63,46.99 65.99,46.99 62.18,50.8 62.18,55.88 57.74,55.88
+12V_NON_PROTECT
  pour Top (rank 2): 34.75,63.5 48.21,63.5 48.21,61.85 47.2,60.83 46.56,60.83 46.44,60.71 46.44,56.39 34.75,56.39
AIR
  Top 0.254: U$5.2 94.82,56.42 86.28,47.88 82.25,47.88 80.98,49.15 TPIC0.6
ALCOHOL
  Top 0.254: TPIC0.7 79.71,49.53 81.87,47.37 86.7,47.37 91.59,52.26 92.65,52.26 94.82,54.42 U$5.3
BATTERY_READ
  Top 0.203: C6.1 35.24,31.88 R2.2 R1.1 33.74,36.3 33.74,41.02 34.62,41.91 MS1.7
CS
  Top 0.203: J2.2 7.14,54.41 7.65,53.9 J1.2
  Bottom 0.203: 13.14,44.93 12.35,45.72 11.12,45.72 7.65,49.2 J1.2
  Bottom 0.254: 13.14,44.93 13.14,35.46 MS1.22
DI
  Top 0.203: J2.3 6.93,55.51 8.64,53.8 8.64,50.29 J1.3 13.34,45.59 14.78,45.59 15.45,44.92 15.45,44.23 16.37,43.31 19.86,43.31 21,44.45 MS1.12
DO
  Top 0.203: MS1.13 18.46,44.45 16.55,46.36 16.33,46.36 15.7,46.98 15.7,47.39 13.16,49.93 J1.7 13.4,50.4 13.4,51.61 13.67,51.89 13.67,61.25 13.19,61.73 10.68,61.73 8.86,59.91 J2.7
EN  (via drill 0.35)
  Top 0.203: U$3.4 57.8,35.24 60.02,37.47 v60.02,39.37 | v65.1,40.64 66.04,40.64 VREG.4
  Bottom 0.203: v60.02,39.37 63.84,39.37 v65.1,40.64
GND  (via drill 0.35)
  other vias: 69.8,50.8 70.82,59.69 73.99,54.61 68.91,57.15 93.04,59.05 91.77,55.24 93.68,43.18 89.23,37.47 89.23,28.57 91.14,28.57 88.6,23.5 88.6,13.97 90.5,14.61 89.87,2.54 92.41,2.54 83.52,26.67 81.61,26.67 79.71,26.67 79.71,32.38 75.27,35.56 75.27,31.75 74.63,26.67 30.82,26.04 34.62,26.04 29.55,40.01 39.07,33.02 53.67,33.02 53.67,30.48 40.34,52.7 40.34,50.8 27.64,62.23 25.1,62.23 27.64,64.77 27.64,67.31 25.1,67.31 25.1,55.24 27.64,59.05 14.94,28.57 37.8,26.04 23.2,36.2 3.13,30.73 15.58,18.41 20.66,5.08 19.39,17.14 15.58,11.43 94.95,2.54 13.04,9.53 58.12,23.5 57.48,30.48 57.48,33.02 63.84,59.05 63.84,57.78 65.99,52.07 65.99,50.8 69.8,53.34 49.23,46.99 54.95,46.99 52.41,46.99 40.34,48.9 50.5,55.24 52.41,54.61 56.85,45.72 56.85,42.55 85.3,33.4 87.08,33.4 84.03,33.4 88.35,33.4 87.96,46.99 81.61,40.01 87.33,20.19 80.34,19.05 83.9,59.31 81.87,54.61 15.19,36.83 12.02,38.1 17.1,6.35 48.21,25.4 46.31,27.3 24.21,39.12 25.35,41.91 16.46,39.37 16.46,34.29 64.09,52.07 64.09,53.34 65.99,53.34 65.99,54.61 65.99,55.88 69.8,48.26 69.8,55.24 3.13,36.2 15.83,49.53 8.84,58.42 18.37,56.52 15.83,52.7 14.56,56.52 5.03,42.55 12.02,41.91 74.25,11.43 74.25,6.99 68.53,14.61 71.07,17.14 72.98,15.88 74.25,3.81 76.79,48.9 74.88,48.9 79.33,35.31
  pour Top (rank 5): -2.59,75.56 114,75.56 114,-3.81 -2.59,-3.81
  pour Bottom (rank 5): -1.32,71.75 108.92,71.75 109.55,72.39 109.55,-1.91 -1.32,-1.91
HB_IN1  (via drill 0.35)
  Top 0.203: DRV8871.2 66.38,67.31 65.74,66.67 65.74,65.91 65.38,65.55 65.38,57.64 67.64,55.38 v67.64,42.55
  Top 0.254: v62.56,22.23 61.93,21.59 v39.7,21.59
  Bottom 0.254: v67.64,42.55 67.64,27.3 v62.56,22.23 | MS1.20 21.32,22.2 39.09,22.2 v39.7,21.59
HB_IN2  (via drill 0.35)
  Top 0.203: 68.28,55.88 65.74,58.42 65.74,65.41 66.38,66.04 DRV8871.3
  Top 0.254: v68.55,42.55 68.55,55.61 68.28,55.88 | v63.21,21.58 62.31,20.68 v39.7,20.68
  Bottom 0.254: v68.55,42.55 68.55,26.93 v63.21,21.58 | MS1.19 19.42,21.56 32.48,21.56 33.36,20.68 v39.7,20.68
LATCH_H_BRIDGE2
  Top 0.203: NOTGATE2.4 79.6,60.33 80.37,60.33 82.14,62.1 83.9,62.1 86.44,64.64 C16.1 88.88,66.19 90.91,66.19 92,67.28 93.02,67.28 DRV8871-2.2
LATCH_H_BRIGDE1
  Top 0.203: NOTGATE1.4 85.82,63.37 88.6,63.37 C7.1 90.12,64.64 91.52,66.04 DRV8871-2.3
LATCHOUT1
  Top 0.254: DRV8871-2.8 99.65,68.58 101.3,66.93 101.3,60.64 99.08,58.42 U$5.14
LATCHOUT2
  Top 0.254: DRV8871-2.6 99.78,66.04 100.66,65.15 100.66,61.59 98.76,59.69 97.39,59.69 U$5.1
LATCHVALVE1
  Top 0.203: TPIC0.4 83.52,56.85 83.37,57 | R12.2 86.39,57 83.37,57 | NOTGATE1.2 80.84,57.14 80.84,57.15 80.99,57.3 81.6,57.3 81.9,57 83.37,57
LATCHVALVE2
  Top 0.203: R13.2 75.77,57.15 75.91,57.3 76.52,57.3 76.67,57.15 76.67,57.14 NOTGATE2.2 77.67,56.15 77.67,56.14 79.2,54.61 79.71,54.61 82.25,52.07 TPIC0.5
MOTOR1
  Top 0.406: DRV8871.8 77.19,68.58 U$2.2 U$2.1
MOTOR2
  Top 0.406: DRV8871.6 75.6,66.04 77.32,64.32 U$2.3 U$2.4
N$1
  Top 0.2: RTC.14 20.66,29.71 C3.1
  Top 0.203: C3.1 18.25,27.3 12.4,27.3 10.34,25.25 10.34,20.2 B2.+
N$2
  Top 0.203: R4.2 15.43,64.75 P_MOS.3
N$3
  Top 0.203: LED.2 11.64,64.77 14.64,67.77 14.64,68.03 LED1.A 17.12,67.94 R4.1
N$4
  Top 0.203: DRV8871.4 R14.2
N$5
  Top 0.203: DRV8871-2.4 91.77,64.77 91.77,64.14 89.39,61.75 R15.2
N$6
  Top 0.203: 8.79,30.91 8.79,32.2 8.48,32.51 0X76.1 | 8.79,30.91 PRESSURE_SENSOR.3 | R10.1 4.17,26.67 5.85,26.67 6.97,27.79 7.57,27.79 8.79,29 8.79,30.91
N$8
  Top 0.203: U$7.2 47.1,58.84 47.1,59.65 49.23,61.78 NMOS.4
N$12
  Top 0.203: LED2.A 59.39,28.75 R11.1
N$15
  pour Top: 60.66,43.18 67.01,43.18 67.01,39.12 60.79,39.12 60.79,43.05
N$16
  Top 0.203: VREG.1 71.9,38.42 CBOOT.1
N$17
  pour Top (rank 2): 64.47,38.61 67.14,38.61 68.91,36.83 73.36,36.83 73.36,33.66 64.47,33.66
N$18
  Top 0.203: C5.1 45.72,53.77 U$7.5
N$19
  pour Top (rank 2): 46.31,55.88 46.31,48.51 48.09,48.51 48.21,48.64 48.21,50.8 51.39,50.8 51.39,53.21 50.75,53.85 48.59,53.85 48.59,55.88
RTC_INT  (via drill 0.35)
  Top 0.203: MS1.6 37.16,47.62 35.9,48.9 25.35,48.9 24.41,49.84 24.41,51.48 23.17,52.72 23.17,61.56 21.54,63.18 SWITCH.3 | v28.02,42.16 27.64,42.55 21.16,42.55 20.66,42.04 RTC.3 20.54,40.77 20.54,39.4 19.24,38.1 13.67,38.1 10.98,40.79 5.41,40.79 1.22,36.61 1.22,23.5 1.99,22.73 EXTERNAL_INT.2
  Bottom 0.203: MS1.6 37.16,42.79 36.54,42.16 v28.02,42.16
S1
  Top 0.305: U$4.1 94.7,40.64 90.12,36.07 84.15,36.07 83.52,36.7 TPIC1.4
S2
  Top 0.305: TPIC1.5 82.25,36.2 83.01,35.43 91.61,35.43 94.82,38.64 U$4.2
S3
  Top 0.305: TPIC1.6 80.98,36.2 82.38,34.8 92.97,34.8 94.82,36.64 U$4.3
S4
  Top 0.305: TPIC1.7 79.71,36.2 81.74,34.16 94.34,34.16 94.82,34.64 U$4.4
S5
  Top 0.305: TPIC1.14 79.71,30.63 81.72,32.64 U$4.5
S6
  Top 0.305: TPIC1.15 80.98,30.48 82.53,32.03 93.43,32.03 94.82,30.64 U$4.6
S7
  Top 0.305: TPIC1.16 82.25,30.48 83.21,31.45 91.76,31.45 94.56,28.64 U$4.7
S8
  Top 0.305: TPIC1.17 83.52,30.1 84.28,30.86 90.6,30.86 94.82,26.64 U$4.8
S9
  Top 0.305: TPIC2.4 83.52,23.37 84.15,22.73 92.91,22.73 94.82,24.64 U$4.9
S10
  Top 0.305: TPIC2.5 82.25,22.86 82.96,22.15 94.33,22.15 94.82,22.64 U$4.10
S11
  Top 0.305: TPIC2.6 80.98,22.86 82.27,21.57 93.89,21.57 94.82,20.64 U$4.11
S12
  Top 0.305: TPIC2.7 79.71,22.86 81.59,20.98 92.48,20.98 94.82,18.64 U$4.12
S13
  Top 0.305: TPIC2.14 79.71,16.56 82.58,19.43 91.39,19.43 94.18,16.64 U$4.13
S14
  Top 0.305: TPIC2.15 80.98,17.06 82.74,18.82 90.62,18.82 94.96,14.49 99.28,14.49 100.66,15.88 100.66,17.41 99.43,18.64 U$4.15
S15
  Top 0.305: TPIC2.16 82.25,17.55 82.93,18.24 90.31,18.24 94.7,13.85 99.54,13.85 101.12,15.43 101.12,18.95 99.43,20.64 U$4.16
S16
  Top 0.305: TPIC2.17 83.52,17.14 84.03,17.65 90,17.65 94.43,13.22 99.8,13.22 101.58,14.99 101.58,20.49 99.43,22.64 U$4.17
S17
  Top 0.305: TPIC3.4 83.52,9.53 83.9,9.14 96.47,9.14 102.04,14.71 102.04,22.04 99.43,24.64 U$4.18
S18
  Top 0.305: TPIC3.5 82.25,9.53 83.27,8.51 96.74,8.51 102.49,14.27 102.49,23.58 99.43,26.64 U$4.19
S19
  Top 0.305: TPIC3.6 80.98,9.53 82.63,7.87 97,7.87 102.95,13.82 102.95,25.12 99.43,28.64 U$4.20
S20
  Top 0.305: TPIC3.7 79.71,9.53 82,7.24 97.26,7.24 103.41,13.38 103.41,26.66 99.43,30.64 U$4.21
S21
  Top 0.305: TPIC3.14 79.71,4.19 82.1,6.58 97.46,6.58 103.97,13.08 103.97,28.11 99.43,32.64 U$4.22
S22
  Top 0.305: TPIC3.15 80.98,4.06 82.91,5.99 97.78,5.99 104.55,12.77 104.55,29.52 99.43,34.64 U$4.23
S23
  Top 0.305: TPIC3.16 82.25,3.81 83.72,5.28 97.97,5.28 105.13,12.45 105.13,30.94 99.43,36.64 U$4.24
S24
  Top 0.305: TPIC3.17 83.52,3.81 84.15,4.45 98.03,4.45 105.72,12.13 105.72,32.35 99.43,38.64 U$4.25
SCK  (via drill 0.35)
  Top 0.203: J1.5 10.95,52.17 10.37,52.75 10.37,54.1 6.7,57.77 5.88,57.77 J2.5 | v11.38,46.35 12.15,45.59 12.24,45.59 12.91,44.92 12.91,44.23 14.19,42.95 22.04,42.95 23.54,44.45 MS1.11
  Bottom 0.203: v11.38,46.35 10.95,46.79 J1.5
SCL  (via drill 0.35)
  Top 0.203: R3.1 25.19,31.51 RTC.16 23.2,28.57 20.4,25.78 15.96,25.78 MS1.18 14.56,24.13 16.46,22.23 v16.46,16.51 | PRESSURE_SENSOR.1 6.33,29.24 v5.67,28.57 | I2C2.P$4 I2C1.P$4 I2C3.P$4 20.41,8.26 20.39,8.26 14.56,14.09 v14.56,14.61
  Bottom 0.203: v5.67,28.57 6.46,27.79 9.72,27.79 13.38,24.13 MS1.18 | v14.56,14.61 v16.46,16.51
SDA  (via drill 0.35)
  Top 0.203: R5.1 24.46,34.92 21.93,32.38 RTC.15 21.93,28.29 20.16,26.52 14.16,26.52 MS1.17 11.77,22.32 12.64,21.44 12.64,18.03 I2C3.P$3 I2C1.P$3 I2C2.P$3 | PRESSURE_SENSOR.7 7.58,37.22 6.96,37.85 v4.78,37.85
  Bottom 0.203: MS1.17 10.06,24.13 8.94,23.01 6.97,23.01 5.04,24.94 5.04,37.59 v4.78,37.85
SENSOR1  (via drill 0.35)
  Top 0.203: R9.2 32.09,47.22 MS1.8 32.09,39.62 v32.97,38.73 | v48.85,14.61 v48.85,18.41 | v48.85,22.86 44.4,27.3 39.96,27.3 38.05,29.21 v38.05,31.75
  Bottom 0.203: ANALOG1.P$3 48.85,12.55 v48.85,14.61 | v48.85,18.41 v48.85,22.86 | v38.05,31.75 38.05,33.66 v32.97,38.73
SENSOR2  (via drill 0.35)
  Top 0.203: R16.2 29.55,47.09 MS1.9 29.55,40.9 30.18,40.27 30.18,40.26 v32.97,37.47 | v47.58,14.61 v47.58,18.41 | v47.58,22.86 43.77,26.67 39.96,26.67 37.42,29.21 v37.42,33.02
  Bottom 0.203: ANALOG2.P$3 47.58,8.81 v47.58,14.61 | v47.58,18.41 v47.58,22.86 | v37.42,33.02 v32.97,37.47
SHIFT_CLK  (via drill 0.35)
  Top 0.203: MS1.23 27,13.59 v27.26,13.34 | v27.26,4.45 28.53,3.17 58.76,3.17 B1.LV3
  Bottom 0.203: v27.26,13.34 v27.26,4.45
SHIFT_DATA
  Top 0.203: B1.LV1 59.14,13.72 39.96,13.72 MS1.24
SHIFT_LATCH
  Top 0.203: MS1.21 26.12,19.94 26.12,12.95 27,12.07 27.52,12.07 28.15,12.7 B1.LV2
SHUTDOWN  (via drill 0.35)
  Top 0.203: D-FLIPFLOP.1 50.65,34.81 v50.65,33.66 R8.2 50.65,29.23 C2.2 | MS1.5 44.79,39.37 v44.79,37.47
  Bottom 0.203: v44.79,37.47 48.59,33.66 v50.65,33.66
T_DATA  (via drill 0.35)
  Top 0.2: v84.15,48.9 84.79,49.53 TPIC0.3
  Bottom 0.2: B1.HV1 76.53,20.95 76.53,44.45 80.98,48.9 v84.15,48.9
T_DATA1
  Top 0.2: TPIC0.18 TPIC1.3
T_DATA2
  Top 0.2: TPIC1.18 TPIC2.3
T_DATA3
  Top 0.2: TPIC2.18 TPIC3.3
T_RCK  (via drill 0.35)
  Top 0.2: TPIC0.12 v77.17,43.81 | v77.17,7.62 TPIC3.12 | v77.17,17.14 TPIC2.12 | v77.17,30.48 TPIC1.12
  Bottom 0.2: v77.17,43.81 v77.17,30.48 v77.17,17.14 v77.17,7.62 75.9,7.62 B1.HV2
T_SCK  (via drill 0.35)
  Top 0.2: TPIC0.13 v78.44,43.81 | v78.44,6.99 TPIC3.13 | v78.44,17.14 TPIC2.13 | v78.44,30.48 TPIC1.13
  Bottom 0.2: v78.44,43.81 v78.44,30.48 v78.44,17.14 v78.44,6.99 76.53,5.08 B1.HV3
TPIC0_4
  Top 0.254: TPIC0.14 79.71,43.81 82,46.1 88.5,46.1 94.82,52.42 U$5.4
TPIC0_5
  Top 0.254: TPIC0.15 80.98,43.81 82.76,45.59 89.99,45.59 94.82,50.42 U$5.5
TPIC0_6
  Top 0.254: TPIC0.16 82.25,43.81 83.39,44.96 91.35,44.96 94.82,48.42 U$5.6
TPIC0_7
  Top 0.254: TPIC0.17 83.52,43.81 84.03,44.32 92.72,44.32 94.82,46.42 U$5.7
WAKE_NOSLEEP  (via drill 0.35)
  Top 0.203: MS1.10 27,45.97 24.06,48.92 24.06,51.33 22.81,52.57 22.81,59.98 SWITCH.2 | P_MOS.1 13.36,63.18 v13.92,62.61
  Bottom 0.203: v13.92,62.61 20.18,62.61 SWITCH.2

### Text on the board
tPlace: Wake? | 0x77 | ANALOG GND +3V | SCL SDA GND +3V